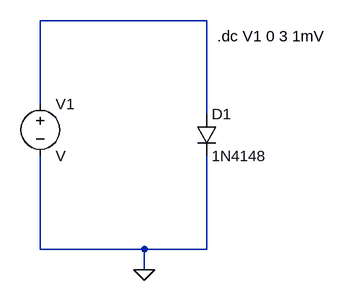
[diagram p0: schematic Experiment 3.asc]
Experiment 3.asc, the LTspice schematic file:
Version 4
SHEET 1 880 680
WIRE 384 -64 128 -64
WIRE 128 64 128 -64
WIRE 384 80 384 -64
WIRE 128 288 128 144
WIRE 288 288 128 288
WIRE 384 288 384 144
WIRE 384 288 288 288
WIRE 288 320 288 288
FLAG 288 320 0
SYMBOL voltage 128 48 R0
SYMATTR InstName V1
SYMBOL diode 368 80 R0
SYMATTR InstName D1
SYMATTR Value 1N4148
TEXT 400 -40 Left 2 !.dc V1 0 3 1mV

The netlist it stands for:
* Experiment 3.asc
V1 N001 0 V
D1 N001 0 1N4148
.model D D
.lib standard.dio
.dc V1 0 3 1mV
.backanno
.end